# Altium project QCopterRCs.PrjPCB
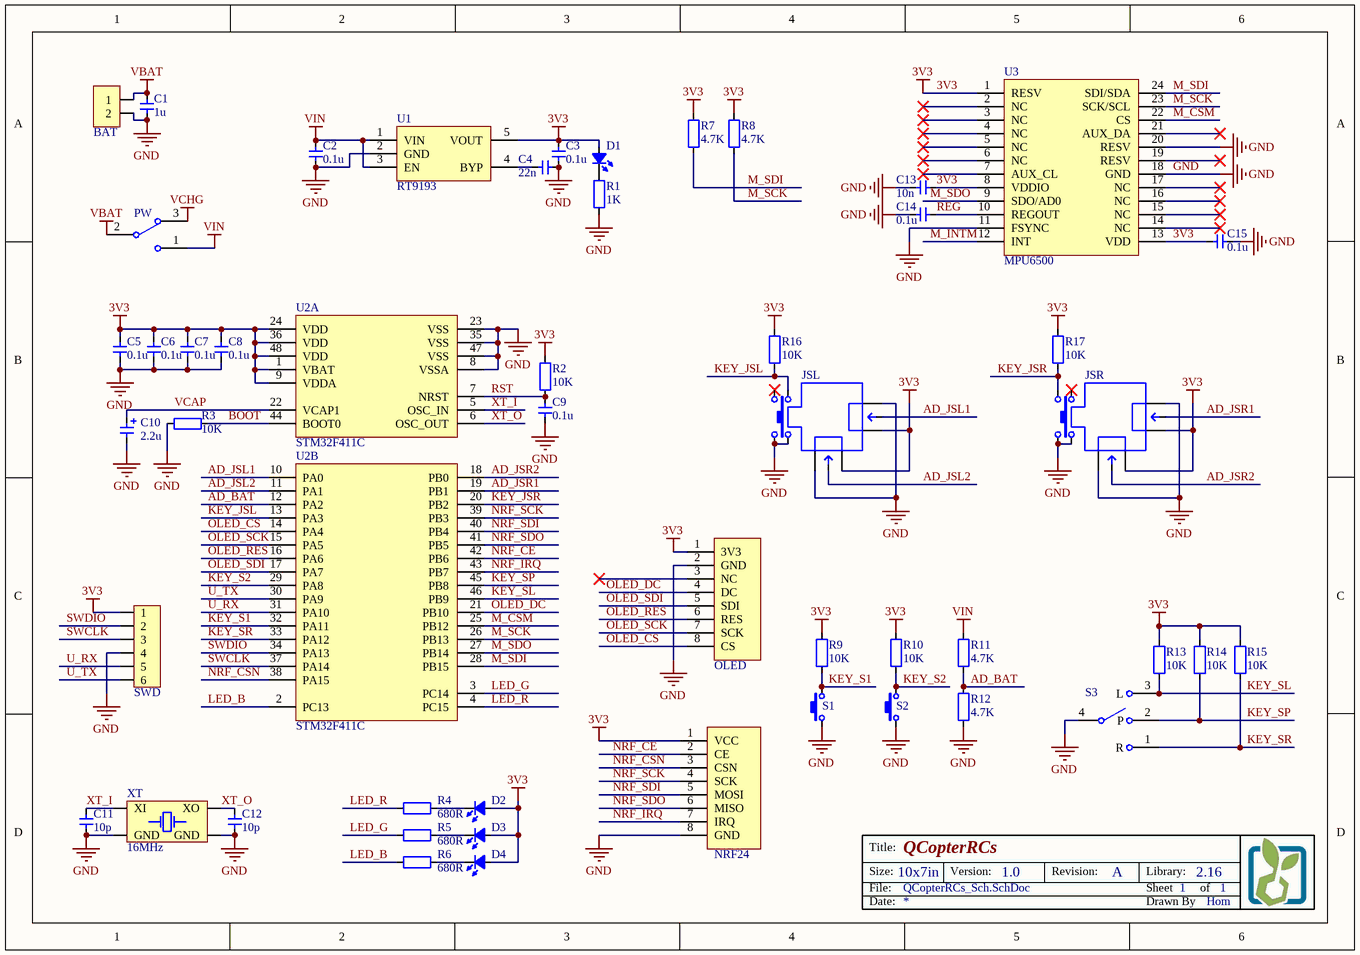
[diagram p0: QCopterRCs_Sch.SchDoc]
1 sheet, 50 parts. Net scope: global (net labels, ports and power ports of the same name join across sheets).
Board file: QCopterRCs_Pcb.PcbDoc

## Sheet QCopterRCs_Sch.SchDoc: QCopterRCs
size 254 x 177 mm; Author: Hom; CompanyName: KitSprout; DrawnBy: Hom; Engineer: Hom; Organization: KitSprout; Revision: A; SheetNumber: 1; SheetTotal: 1; Version: 1.0; LibVersion: 2.16

### Parts
BAT  MX1.25_2P  [MX1.25_S90_2P]  (value not drawn)
C1  value 1u  [CAP_0603]  (hidden comment: Cap_0603)
C2  value 0.1u  [CAP_0603]  (hidden comment: Cap_0603)
C3  value 0.1u  [CAP_0603]  (hidden comment: Cap_0603)
C4  value 22n  [CAP_0603]  (hidden comment: Cap_0603)
C5  value 0.1u  [CAP_0603]  (hidden comment: Cap_0603)
C6  value 0.1u  [CAP_0603]  (hidden comment: Cap_0603)
C7  value 0.1u  [CAP_0603]  (hidden comment: Cap_0603)
C8  value 0.1u  [CAP_0603]  (hidden comment: Cap_0603)
C9  value 0.1u  [CAP_0603]  (hidden comment: Cap_0603)
C10  value 2.2u  [CAP_TAN_P0805]  (hidden comment: Cap_Tan_0805)
C11  value 10p  [CAP_0603]  (hidden comment: Cap_0603)
C12  value 10p  [CAP_0603]  (hidden comment: Cap_0603)
C13  value 10n  [CAP_0603]  (hidden comment: Cap_0603)
C14  value 0.1u  [CAP_0603]  (hidden comment: Cap_0603)
C15  value 0.1u  [CAP_0603]  (hidden comment: Cap_0603)
D1  LED_0603  [LED_0603_YELLOW]  (value not drawn)
D2  LED_0805  [LED_0805_RED]  (value not drawn)
D3  LED_0805  [LED_0805_GREEN]  (value not drawn)
D4  LED_0805  [LED_0805_BLUE]  (value not drawn)
JSL  JoyStick  [JoyStick]  (value not drawn)
JSR  JoyStick  [JoyStick]  (value not drawn)
NRF24  nRF24L01P_PA_LNA  [NRF24L01P_PA_LNA]  (value not drawn)
OLED  OLED_1.5_128*128  [OLED_1.5_128x128]  (value not drawn)
PW  SwitchSPDT_2.8x6.6_90  [SwitchSPDT_2.8X6.6_90]  (value not drawn)
R1  value 1K  [RES_0603]  (hidden comment: Res_0603)
R2  value 10K  [RES_0603]  (hidden comment: Res_0603)
R3  value 10K  [RES_0603]  (hidden comment: Res_0603)
R4  value 680R  [RES_0603]  (hidden comment: Res_0603)
R5  value 680R  [RES_0603]  (hidden comment: Res_0603)
R6  value 680R  [RES_0603]  (hidden comment: Res_0603)
R7  value 4.7K  [RES_0603]  (hidden comment: Res_0603)
R8  value 4.7K  [RES_0603]  (hidden comment: Res_0603)
R9  value 10K  [RES_0603]  (hidden comment: Res_0603)
R10  value 10K  [RES_0603]  (hidden comment: Res_0603)
R11  value 4.7K  [RES_0603]  (hidden comment: Res_0603)
R12  value 4.7K  [RES_0603]  (hidden comment: Res_0603)
R13  value 10K  [RES_0603]  (hidden comment: Res_0603)
R14  value 10K  [RES_0603]  (hidden comment: Res_0603)
R15  value 10K  [RES_0603]  (hidden comment: Res_0603)
R16  value 10K  [RES_0603]  (hidden comment: Res_0603)
R17  value 10K  [RES_0603]  (hidden comment: Res_0603)
S1  ButtonTACT_3x6x2.5_180  [ButtonTACT_3x6x2.5_180]  (value not drawn)
S2  ButtonTACT_3x6x2.5_180  [ButtonTACT_3x6x2.5_180]  (value not drawn)
S3  ButtonPushLever_11*12_90  [ButtonPushLever_11*12_90]  (value not drawn)
SWD  HDR1x6_1.27  [HDR1X6_1.27_180HF]  (value not drawn)
U1  RT9193  [SOT23-5]
U2  STM32F411C  [QFN_P0.5_48]  (parts A,B of 2)
U3  MPU6500  [QFN_P0.4_24]
XT  value 16MHz  [XT_2520_4]  (hidden comment: XTAL_2520_4P)

### Nets
3V3: C3.2 C5.2 C6.2 C7.2 C8.2 C13.1 C15.2 D1.1(A) D2.1(A) D3.1(A) D4.1(A) JSL.3 JSL.4 JSR.3 JSR.4 NRF24.1(VCC) OLED.1(3V3) R2.2 R7.2 R8.2 R9.2 R10.2 R13.2 R14.2 R15.2 R16.2 R17.2 SWD.1 U1.5(VOUT) U2.1(VBAT) U2.9(VDDA) U2.24(VDD) U2.36(VDD) U2.48(VDD) U3.1(RESV) U3.8(VDDIO) U3.13(VDD)
GND: BAT.2 C1.1 C2.1 C3.1 C4.1 C5.1 C6.1 C7.1 C8.1 C9.1 C10.2 C11.1 C12.1 C13.2 C14.2 C15.1 JSL.1 JSL.6 JSL.8 JSL.10 JSR.1 JSR.6 JSR.8 JSR.10 NRF24.8(GND) OLED.2(GND) R1.1 R3.2 R12.1 S1.1 S2.1 S3.4 SWD.4 U1.2(GND) U2.8(VSSA) U2.23(VSS) U2.35(VSS) U2.47(VSS) U3.11(FSYNC) U3.18(GND) U3.20(RESV) XT.2(GND) XT.4(GND)
VBAT: BAT.1 C1.2 PW.2
VCHG: PW.3
VIN: C2.2 PW.1 R11.2 U1.1(VIN) U1.3(EN)
AD_BAT: R11.1 R12.2 U2.12(PA2)
AD_JSL1: JSL.5 U2.10(PA0)
AD_JSL2: JSL.2 U2.11(PA1)
AD_JSR1: JSR.5 U2.19(PB1)
AD_JSR2: JSR.2 U2.18(PB0)
BOOT: R3.1 U2.44(BOOT0)
KEY_JSL: JSL.9 R16.1 U2.13(PA3)
KEY_JSR: JSR.7 R17.1 U2.20(PB2)
KEY_S1: R9.1 S1.2 U2.32(PA11)
KEY_S2: R10.1 S2.2 U2.29(PA8)
KEY_SL: R13.1 S3.3(L) U2.46(PB9)
KEY_SP: R14.1 S3.2(P) U2.45(PB8)
KEY_SR: R15.1 S3.1(R) U2.33(PA12)
LED_B: R6.1 U2.2(PC13)
LED_G: R5.1 U2.3(PC14)
LED_R: R4.1 U2.4(PC15)
M_CSM: U2.25(PB12) U3.22(CS)
M_INTM: U3.12(INT)
M_SCK: R8.1 U2.26(PB13) U3.23(SCK/SCL)
M_SDI: R7.1 U2.28(PB15) U3.24(SDI/SDA)
M_SDO: U2.27(PB14) U3.9(SDO/AD0)
NRF_CE: NRF24.2(CE) U2.42(PB6)
NRF_CSN: NRF24.3(CSN) U2.38(PA15)
NRF_IRQ: NRF24.7(IRQ) U2.43(PB7)
NRF_SCK: NRF24.4(SCK) U2.39(PB3)
NRF_SDI: NRF24.5(MOSI) U2.40(PB4)
NRF_SDO: NRF24.6(MISO) U2.41(PB5)
OLED_CS: OLED.8(CS) U2.14(PA4)
OLED_DC: OLED.4(DC) U2.21(PB10)
OLED_RES: OLED.6(RES) U2.16(PA6)
OLED_SCK: OLED.7(SCK) U2.15(PA5)
OLED_SDI: OLED.5(SDI) U2.17(PA7)
REG: C14.1 U3.10(REGOUT)
RST: C9.2 R2.1 U2.7(NRST)
SWCLK: SWD.3 U2.37(PA14)
SWDIO: SWD.2 U2.34(PA13)
U_RX: SWD.5 U2.31(PA10)
U_TX: SWD.6 U2.30(PA9)
VCAP: C10.1 U2.22(VCAP1)
XT_I: C11.2 U2.5(OSC_IN) XT.1(XI)
XT_O: C12.2 U2.6(OSC_OUT) XT.3(XO)
NetC4_2: C4.2 U1.4(BYP)
NetD1_2: D1.2(K) R1.2
NetD2_2: D2.2(K) R4.2
NetD3_2: D3.2(K) R5.2
NetD4_2: D4.2(K) R6.2

Not connected (* = marked no-connect by the designer): JSL 7*; JSR 9*; OLED 3(NC)*; U3 2(NC)* 3(NC)* 4(NC)* 5(NC)* 6(NC)* 7(AUX_CL)* 14(NC)* 15(NC)* 16(NC)* 17(NC)* 19(RESV)* 21(AUX_DA)*

### Notes on the sheet
- Title:
- Size:
- Date:
- File:
- 10x7in
- Version:
- Revision:
- Sheet
- Drawn By
- Library:
- of

### Library data of the parts
BAT = MX1.25_2P: MX
C1-C9 C11-C15 = Cap_0603: Capacitor
C10 = Cap_Tan_0805: Capacitor
D1 = LED_0603: LED
D2-D4 = LED_0805: LED
NRF24 = nRF24L01P_PA_LNA: Module
OLED = OLED_1.5_128*128: Module
PW = SwitchSPDT_2.8x6.6_90: Switch
R1-R17 = Res_0603: Resistor
S1 S2 = ButtonTACT_3x6x2.5_180: Button
S3 = ButtonPushLever_11*12_90: Button
SWD = HDR1x6_1.27: Header
U1 = RT9193: Power
U2 = STM32F4x1C: MCU
U3 = MPU925x: Sensor Motion
XT = XTAL_2520_4P: Crystal Oscillator